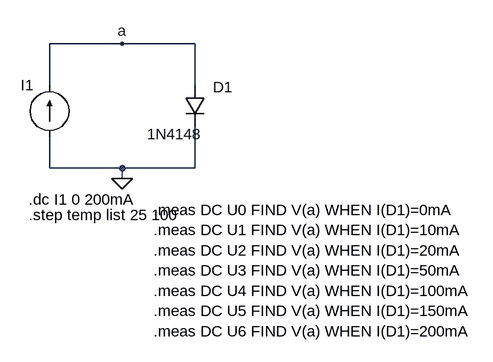
[diagram p0: schematic Diode-VI-meas-F.asc]
Diode-VI-meas-F.asc, the LTspice schematic file:
Version 4
SHEET 1 880 680
WIRE 48 160 -64 160
WIRE 160 160 48 160
WIRE -64 224 -64 160
WIRE 160 224 160 160
WIRE -64 352 -64 304
WIRE 48 352 -64 352
WIRE 160 352 160 288
WIRE 160 352 48 352
WIRE 48 368 48 352
FLAG 48 368 0
FLAG 48 160 a
SYMBOL diode 144 224 R0
WINDOW 0 44 3 Left 2
WINDOW 3 -58 75 Left 2
SYMATTR InstName D1
SYMATTR Value 1N4148
SYMBOL current -64 304 R180
WINDOW 0 24 80 Left 2
WINDOW 3 24 0 Invisible 2
WINDOW 123 0 0 Left 2
WINDOW 39 0 0 Left 2
SYMATTR InstName I1
SYMATTR Value 0
TEXT -96 400 Left 2 !.dc I1 0 200mA
TEXT -96 424 Left 2 !.step temp list 25 100
TEXT 96 416 Left 2 !.meas DC U0 FIND V(a) WHEN I(D1)=0mA\n.meas DC U1 FIND V(a) WHEN I(D1)=10mA\n.meas DC U2 FIND V(a) WHEN I(D1)=20mA\n.meas DC U3 FIND V(a) WHEN I(D1)=50mA\n.meas DC U4 FIND V(a) WHEN I(D1)=100mA\n.meas DC U5 FIND V(a) WHEN I(D1)=150mA\n.meas DC U6 FIND V(a) WHEN I(D1)=200mA

The netlist it stands for:
* Diode-VI-meas-F.asc
D1 a 0 1N4148
I1 0 a 0
.model D D
.lib standard.dio
.dc I1 0 200mA
.step temp list 25 100
.meas DC U0 FIND V(a) WHEN I(D1)=0mA
.meas DC U1 FIND V(a) WHEN I(D1)=10mA
.meas DC U2 FIND V(a) WHEN I(D1)=20mA
.meas DC U3 FIND V(a) WHEN I(D1)=50mA
.meas DC U4 FIND V(a) WHEN I(D1)=100mA
.meas DC U5 FIND V(a) WHEN I(D1)=150mA
.meas DC U6 FIND V(a) WHEN I(D1)=200mA
.backanno
.end